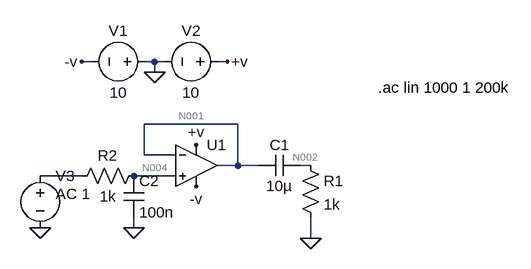
[diagram p0: schematic bandpass_active.asc]
bandpass_active.asc, the LTspice schematic file:
Version 4
SHEET 1 880 680
WIRE 0 80 -16 80
WIRE 96 80 80 80
WIRE 112 80 96 80
WIRE 208 80 192 80
WIRE 96 96 96 80
WIRE 224 176 80 176
WIRE 80 224 80 176
WIRE 128 224 80 224
WIRE 224 240 224 176
WIRE 224 240 192 240
WIRE 256 240 224 240
WIRE 336 240 320 240
WIRE -16 256 -80 256
WIRE 128 256 64 256
WIRE 64 336 64 320
WIRE 336 352 336 320
FLAG 96 96 0
FLAG 208 80 +v
FLAG -16 80 -v
FLAG 336 352 0
FLAG 64 336 0
FLAG 160 208 +v
FLAG 160 272 -v
FLAG -80 336 0
SYMBOL voltage 96 80 R90
WINDOW 0 -32 56 VBottom 2
WINDOW 3 32 56 VTop 2
WINDOW 123 0 0 Left 2
WINDOW 39 0 0 Left 2
SYMATTR InstName V1
SYMATTR Value 10
SYMBOL voltage 208 80 R90
WINDOW 0 -32 56 VBottom 2
WINDOW 3 32 56 VTop 2
WINDOW 123 0 0 Left 2
WINDOW 39 0 0 Left 2
SYMATTR InstName V2
SYMATTR Value 10
SYMBOL Opamps\\UniversalOpamp2 160 240 R0
SYMATTR InstName U1
SYMBOL voltage -80 240 R0
WINDOW 3 24 44 Left 2
WINDOW 123 24 44 Left 2
WINDOW 39 0 0 Left 2
SYMATTR Value ""
SYMATTR Value2 AC 1
SYMATTR InstName V3
SYMBOL res 320 224 R0
SYMATTR InstName R1
SYMATTR Value 1k
SYMBOL cap 320 224 R90
WINDOW 0 0 32 VBottom 2
WINDOW 3 32 32 VTop 2
SYMATTR InstName C1
SYMATTR Value 10µ
SYMBOL cap 48 256 R0
SYMATTR InstName C2
SYMATTR Value 100n
SYMBOL res 80 240 R90
WINDOW 0 0 56 VBottom 2
WINDOW 3 32 56 VTop 2
SYMATTR InstName R2
SYMATTR Value 1k
TEXT 440 120 Left 2 !.ac lin 1000 1 200k

The netlist it stands for:
* bandpass_active.asc
V1 0 -v 10
V2 +v 0 10
XU1 N004 N001 +v -v N001 level.2 Avol=1Meg GBW=10Meg Slew=10Meg ilimit=25m rail=0 Vos=0 phimargin=45 en=0 enk=0 in=0 ink=0 Rin=500Meg  ; pins IN+ IN- V+ V- OUT
V3 N003 0 AC 1
R1 N002 0 1k
C1 N002 N001 10µ
C2 N004 0 100n
R2 N004 N003 1k
.ac lin 1000 1 200k
.lib UniversalOpamps2.sub
.backanno
.end

* Results of the author's LTspice run, read from the files saved beside the schematic
* Operating Point, zero values left out:
*   V(-v) = -10 V
*   V(+v) = 10 V
*   I(V2) = -999.5 µA
*   I(V1) = -999.5 µA
*   Ix(u1:3) = 999.5 µA
*   Ix(u1:4) = -999.5 µA
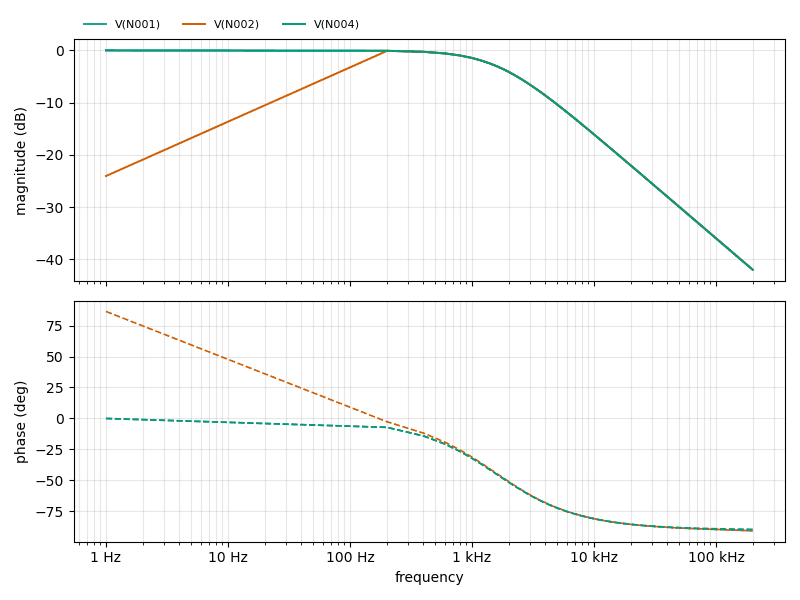
[diagram p1: AC Analysis of bandpass_active.asc, plotted from the saved traces]
* AC Analysis, 1 run:
*   V(N001): -0.00 dB at 1 Hz, -41.99 dB at 200 kHz, peak -0.00 dB at 1 Hz, 3 dB below the peak at 1.591 kHz
*   V(N002): -24.05 dB at 1 Hz, -41.99 dB at 200 kHz, peak -0.10 dB at 201.2 Hz, 3 dB below the peak at 103.3 Hz and 1.625 kHz
*   V(N004): -0.00 dB at 1 Hz, -41.98 dB at 200 kHz, peak -0.00 dB at 1 Hz, 3 dB below the peak at 1.591 kHz